# Altium project FanControl.PrjPcb
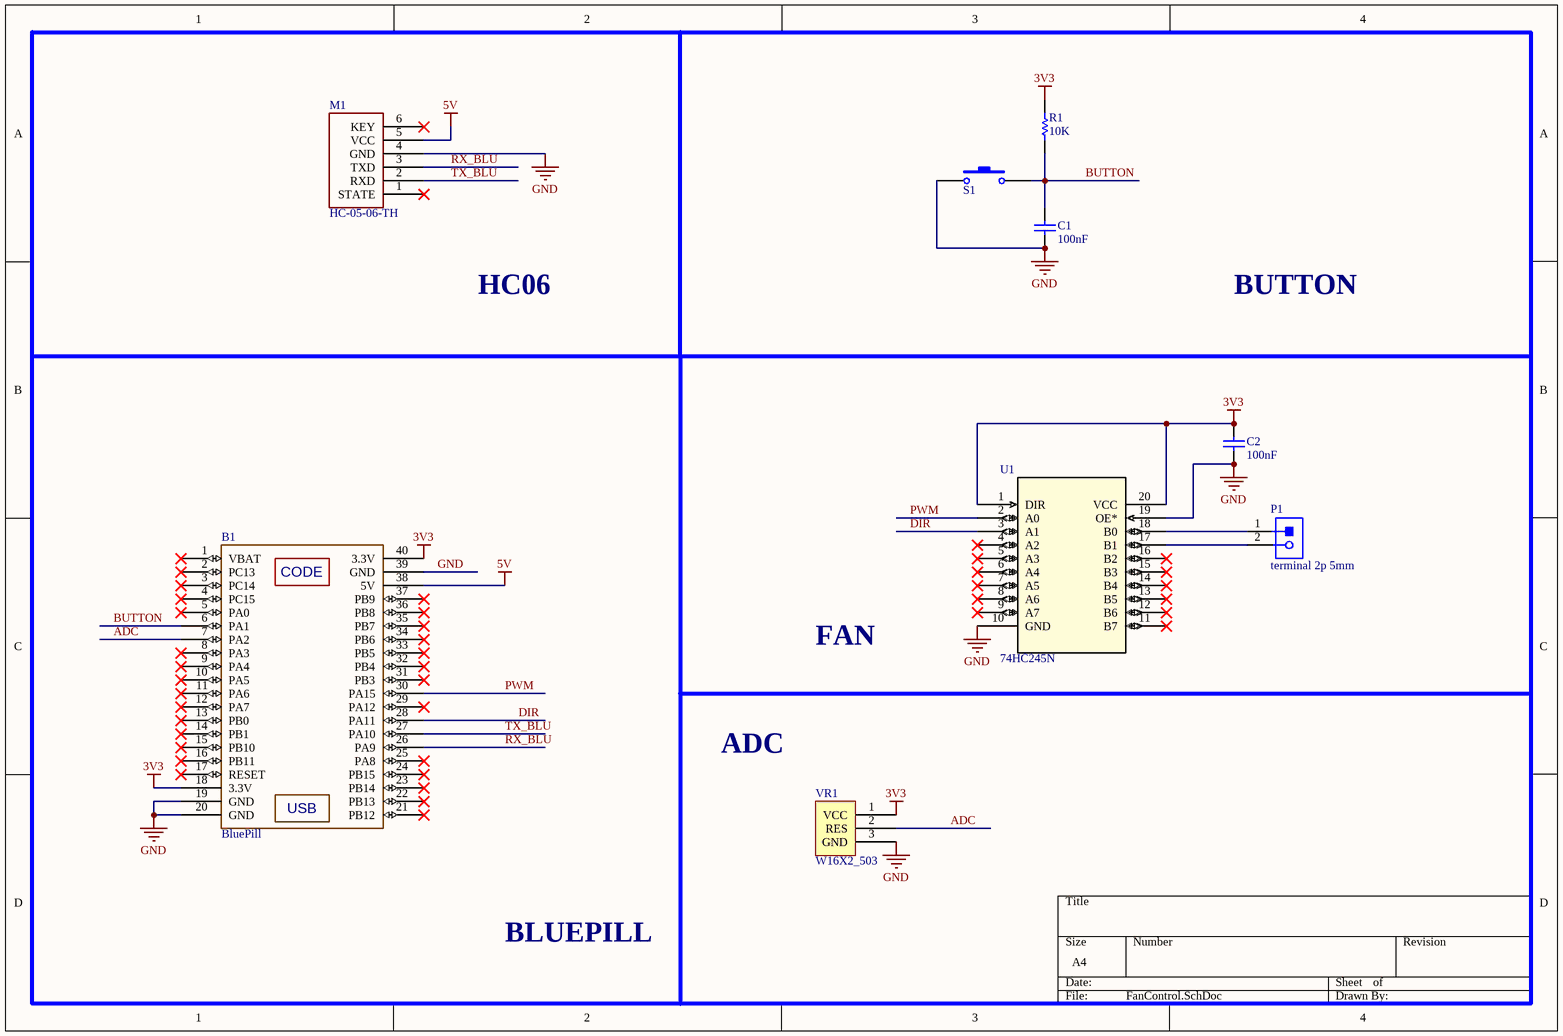
[diagram p0: FanControl.SchDoc]
1 sheet, 9 parts. Net scope: global (net labels, ports and power ports of the same name join across sheets).
Board file: FanControl.PcbDoc

## Sheet FanControl.SchDoc
size A4; SheetNumber: 1; SheetTotal: 1

### Parts
B1  BluePill  [BlUEPILL]
C1  value 100nF  [CAP-SM-0805]  (hidden comment: Cap Non-Pol SMD)
C2  value 100nF  [CAP-SM-0805]  (hidden comment: Cap Non-Pol SMD)
M1  HC-05-06-TH  [HC-05-06-TH]
P1  terminal 2p 5mm  [terminal 2p 5mm]
R1  value 10K  [RES-SM-0603]  (hidden comment: RESISTOR SMD)
S1  Tact SW - 2Pin  [SW2]  (value not drawn)
U1  74HC245N  [74HC245N]
VR1  W16X2_503  [W16X2_503]

### Nets
3V3: B1.18(3.3V) B1.40(3.3V) C2.2 R1.2 U1.1(DIR) U1.20(VCC) VR1.1(VCC)
5V: B1.38(5V) M1.5(VCC)
GND: B1.19(GND) B1.20(GND) B1.39(GND) C1.1 C2.1 M1.4(GND) S1.1 U1.10(GND) U1.19(OE*) VR1.3(GND)
ADC: B1.7(PA2) VR1.2(RES)
BUTTON: B1.6(PA1) C1.2 R1.1 S1.2
DIR: B1.28(PA11) U1.3(A1)
PWM: B1.30(PA15) U1.2(A0)
RX_BLU: B1.26(PA9) M1.3(TXD)
TX_BLU: B1.27(PA10) M1.2(RXD)
NetP1_1: P1.1 U1.18(B0)
NetP1_2: P1.2 U1.17(B1)

Not connected (* = marked no-connect by the designer): B1 1(VBAT)* 2(PC13)* 3(PC14)* 4(PC15)* 5(PA0)* 8(PA3)* 9(PA4)* 10(PA5)* 11(PA6)* 12(PA7)* 13(PB0)* 14(PB1)* 15(PB10)* 16(PB11)* 17(RESET)* 21(PB12)* 22(PB13)* 23(PB14)* 24(PB15)* 25(PA8)* 29(PA12)* 31(PB3)* 32(PB4)* 33(PB5)* 34(PB6)* 35(PB7)* 36(PB8)* 37(PB9)*; M1 1(STATE)* 6(KEY)*; U1 4(A2)* 5(A3)* 6(A4)* 7(A5)* 8(A6)* 9(A7)* 11(B7)* 12(B6)* 13(B5)* 14(B4)* 15(B3)* 16(B2)*

### Notes on the sheet
- HC06
- BUTTON
- FAN
- ADC
- BLUEPILL
- (in symbol BluePill) CODE; USB

### Library data of the parts
C1 C2 = Cap Non-Pol SMD: Capacitor
R1 = RESISTOR SMD: Resistor
S1 = Tact SW - 2Pin: Switch button 2 pin
U1 = 74HC245N: No Description Available; Mfr_Name: NXP; Copyright: Copyright (C) 2022 Ultra Librarian. All rights reserved.; Manufacturer_Part_Number: 74HC245N; RefDes: RefDes; Type: DEV
M1 = HC-05-06-TH: Manufacturer: *; Manufacturer Part Number: *; Local Supplier: thegioiic; Local Supplier Part Numer: *; Local Supplier Link: https://www.thegioiic.com/products/hc-05-thu-phat-bluetooth-ra-chan-master-slave